# Altium project Toshiba_CB_3.PrjPcb
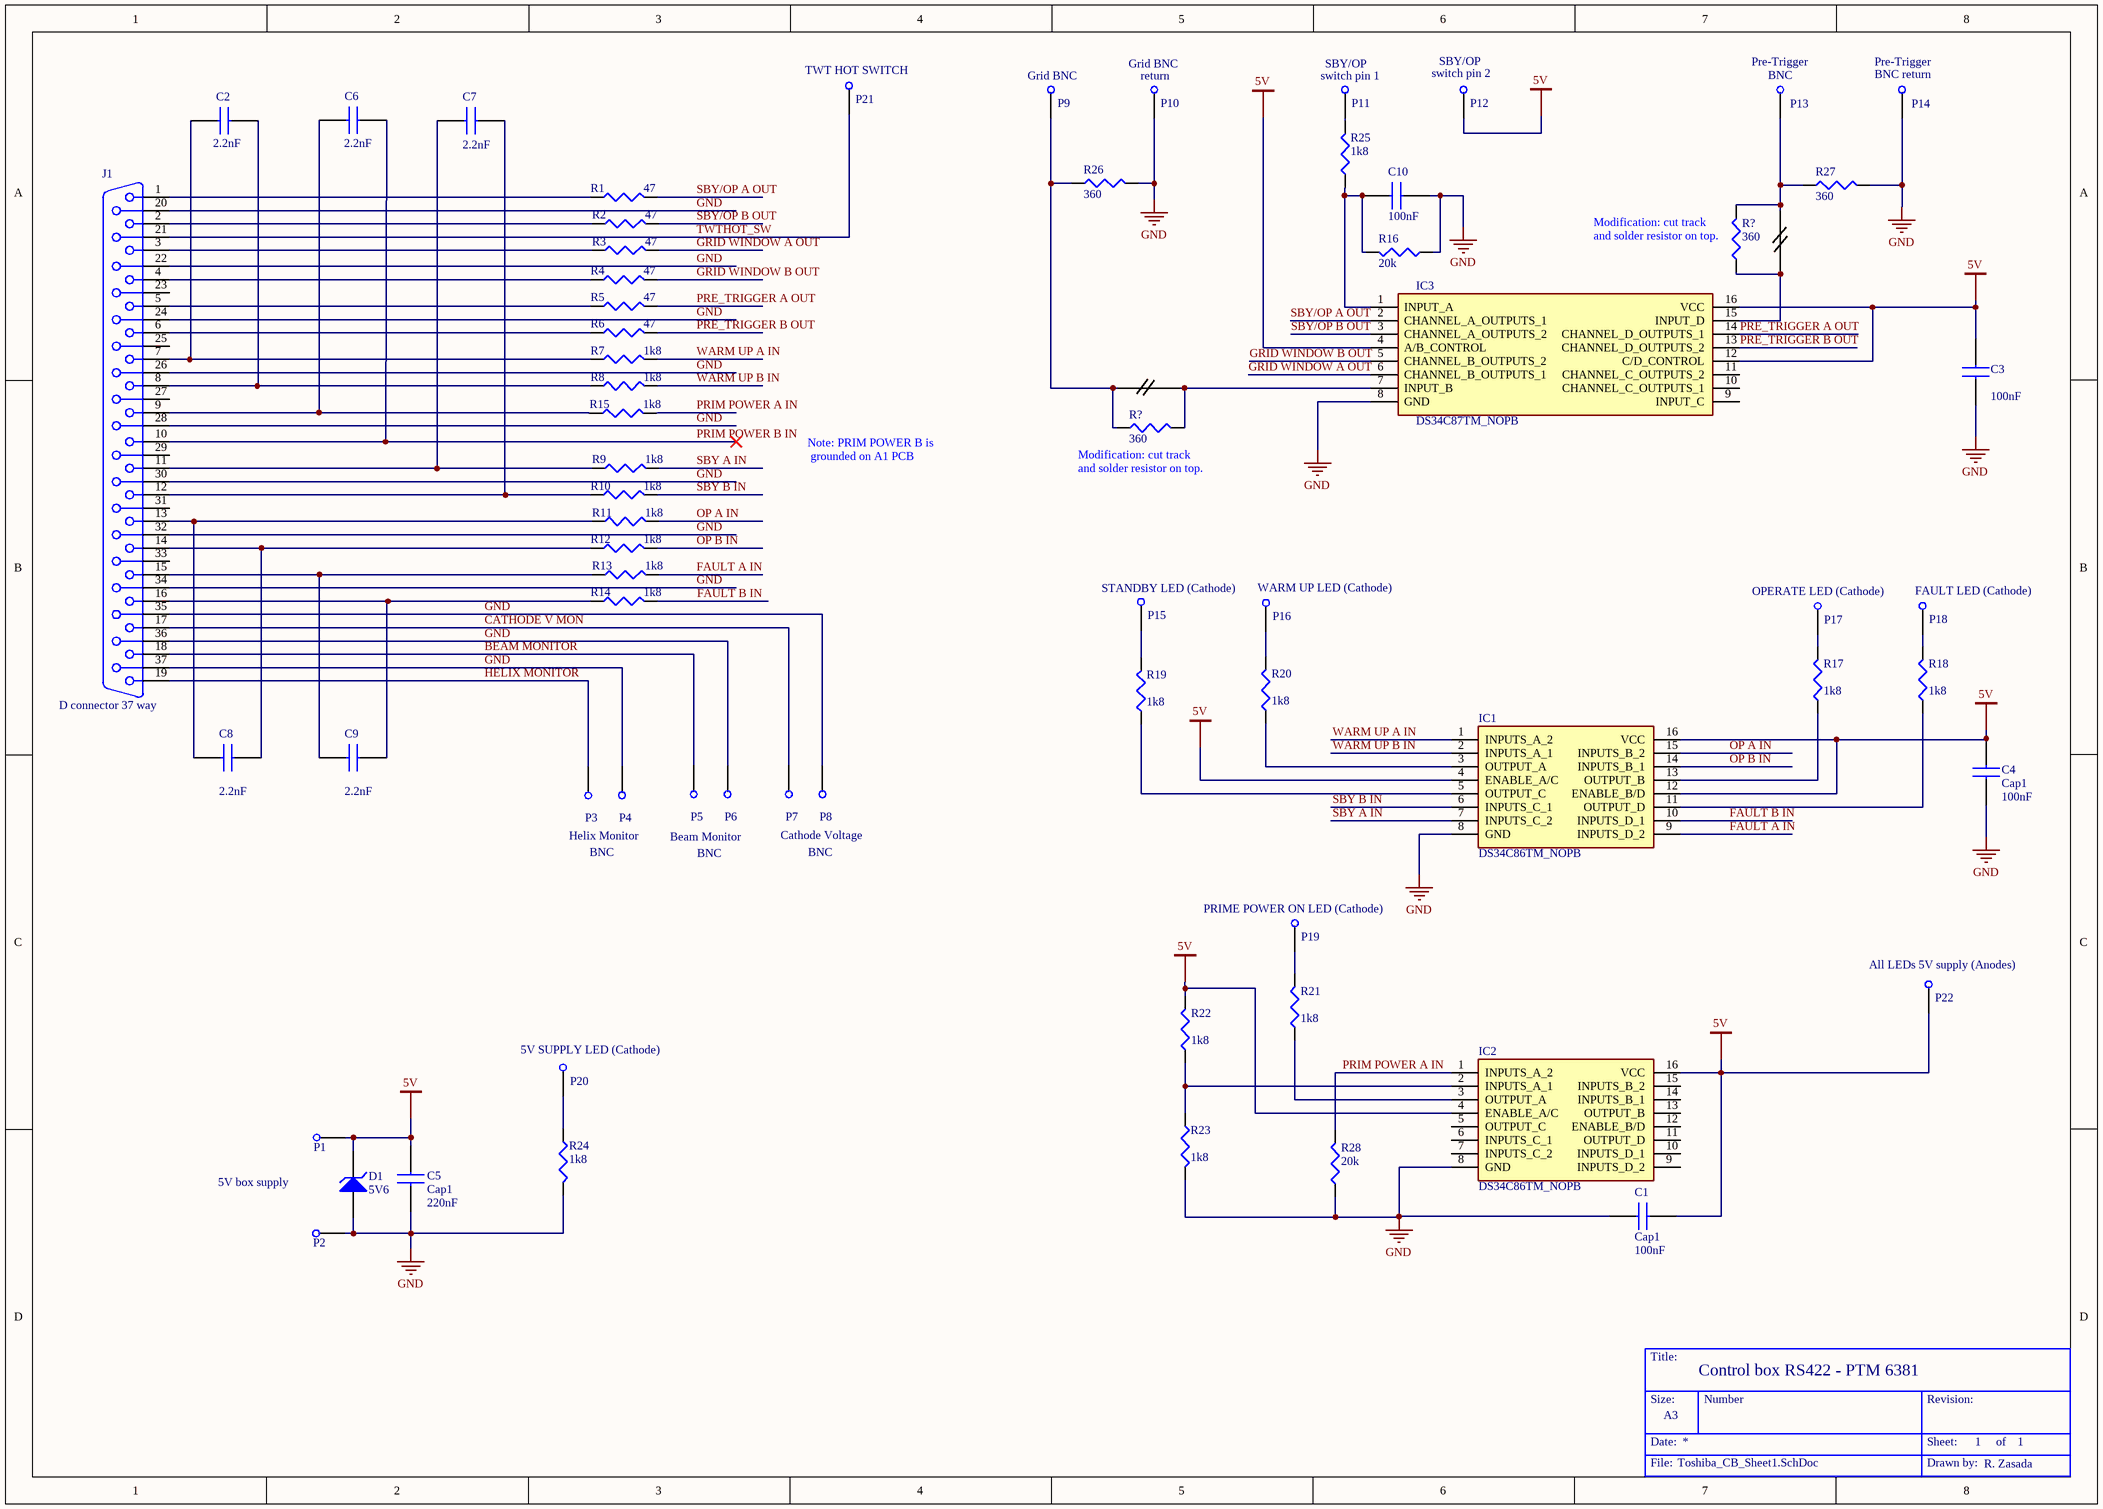
[diagram p0: Toshiba_CB_Sheet1.SchDoc]
1 sheet, 68 parts. Net scope: global (net labels, ports and power ports of the same name join across sheets).
Board file: Toshiba_CB_PCB1.PcbDoc

## Sheet Toshiba_CB_Sheet1.SchDoc: RS422 Control Box PTM 6381
size A3; CompanyName: TMD Technologies; Organization: TMD Technologies; DocumentNumber: 1; Revision: 1; SheetNumber: 1; SheetTotal: 1

### Parts
(Parts that share a designator on the sheet are numbered #1, #2 ... from top to bottom, then left to right.)
*  Title Block  (value not drawn)  (graphical)
C1  Cap1  value 100nF  [CAPC2012X94N]
C2  value 2.2nF  [CAPC2012X94N]  (hidden comment: Cap1)
C3  value 100nF  [CAPC2012X94N]  (hidden comment: Cap1)
C4  Cap1  value 100nF  [CAPC2012X94N]
C5  Cap1  value 220nF  [CAPC2012X94N]
C6  value 2.2nF  [CAPC2012X94N]  (hidden comment: Cap1)
C7  value 2.2nF  [CAPC2012X94N]  (hidden comment: Cap1)
C8  value 2.2nF  [CAPC2012X94N]  (hidden comment: Cap1)
C9  value 2.2nF  [CAPC2012X94N]  (hidden comment: Cap1)
C10  value 100nF  [CAPC2012X94N]  (hidden comment: Cap1)
D1  5V6  [Diode]
IC1  DS34C86TM_NOPB  [SOIC127P600X175-16N]
IC2  DS34C86TM_NOPB  [SOIC127P600X175-16N]
IC3  DS34C87TM_NOPB  [SOIC127P600X175-16N]
J1  D connector 37 way  [D connector 37 way]
P1  Pin1  [pin1]  (value not drawn)
P2  Pin1  [pin1]  (value not drawn)
P3  Pin1  [pin1]  (value not drawn)
P4  Pin1  [pin1]  (value not drawn)
P5  Pin1  [pin1]  (value not drawn)
P6  Pin1  [pin1]  (value not drawn)
P7  Pin1  [pin1]  (value not drawn)
P8  Pin1  [pin1]  (value not drawn)
P9  Pin1  [pin1]  (value not drawn)
P10  Pin1  [pin1]  (value not drawn)
P11  Pin1  [pin1]  (value not drawn)
P12  Pin1  [pin1]  (value not drawn)
P13  Pin1  [pin1]  (value not drawn)
P14  Pin1  [pin1]  (value not drawn)
P15  Pin1  [pin1]  (value not drawn)
P16  Pin1  [pin1]  (value not drawn)
P17  Pin1  [pin1]  (value not drawn)
P18  Pin1  [pin1]  (value not drawn)
P19  Pin1  [pin1]  (value not drawn)
P20  Pin1  [pin1]  (value not drawn)
P21  Pin1  [pin1]  (value not drawn)
P22  Pin1  [pin1]  (value not drawn)
R1  value 47  [Res1 0805]  (hidden comment: Res1)
R2  value 47  [Res1 0805]  (hidden comment: Res1)
R3  value 47  [Res1 0805]  (hidden comment: Res1)
R4  value 47  [Res1 0805]  (hidden comment: Res1)
R5  value 47  [Res1 0805]  (hidden comment: Res1)
R6  value 47  [Res1 0805]  (hidden comment: Res1)
R7  value 1k8  [Res1 0805]  (hidden comment: Res1)
R8  value 1k8  [Res1 0805]  (hidden comment: Res1)
R9  value 1k8  [Res1 0805]  (hidden comment: Res1)
R10  value 1k8  [Res1 0805]  (hidden comment: Res1)
R11  value 1k8  [Res1 0805]  (hidden comment: Res1)
R12  value 1k8  [Res1 0805]  (hidden comment: Res1)
R13  value 1k8  [Res1 0805]  (hidden comment: Res1)
R14  value 1k8  [Res1 0805]  (hidden comment: Res1)
R15  value 1k8  [Res1 0805]  (hidden comment: Res1)
R16  value 20k  [Res1 0805]  (hidden comment: Res1)
R17  value 1k8  [Res1 0805]  (hidden comment: Res1)
R18  value 1k8  [Res1 0805]  (hidden comment: Res1)
R19  value 1k8  [Res1 0805]  (hidden comment: Res1)
R20  value 1k8  [Res1 0805]  (hidden comment: Res1)
R21  value 1k8  [Res1 0805]  (hidden comment: Res1)
R22  value 1k8  [Res1 0805]  (hidden comment: Res1)
R23  value 1k8  [Res1 0805]  (hidden comment: Res1)
R24  value 1k8  [Res1 0805]  (hidden comment: Res1)
R25  value 1k8  [Res1 0805]  (hidden comment: Res1)
R26  value 360  [Res1 0805]  (hidden comment: Res1)
R27  value 360  [Res1 0805]  (hidden comment: Res1)
R28  value 20k  [Res1 0805]  (hidden comment: Res1)
R?#1  value 360  [Res1 0805]  (hidden comment: Res1)
R?#2  value 360  [Res1 0805]  (hidden comment: Res1)

### Nets
5V: C1.1 C3.1 C4.1 C5.2 D1.2(K) IC1.4(ENABLE_A/C) IC1.12(ENABLE_B/D) IC1.16(VCC) IC2.4(ENABLE_A/C) IC2.16(VCC) IC3.4(A/B_CONTROL) IC3.12(C/D_CONTROL) IC3.16(VCC) P1.1 P12.1 P22.1 R22.2
GND: C1.2 C3.2 C4.2 C5.1 C10.1 D1.1(A) IC1.8(GND) IC2.8(GND) IC3.8(GND) J1.20 J1.22 J1.24 J1.26 J1.28 J1.30 J1.32 J1.34 J1.35 J1.36 J1.37 P2.1 P4.1 P6.1 P8.1 P10.1 P14.1 R16.1 R23.2 R24.2 R26.2 R27.2 R28.1
BEAM MONITOR: J1.18 P5.1
CATHODE V MON: J1.17 P7.1
FAULT A IN: IC1.9(INPUTS_D_2) R13.2
FAULT B IN: IC1.10(INPUTS_D_1) R14.2
GRID WINDOW A OUT: IC3.6(CHANNEL_B_OUTPUTS_1) R3.2
GRID WINDOW B OUT: IC3.5(CHANNEL_B_OUTPUTS_2) R4.2
HELIX MONITOR: J1.19 P3.1
OP A IN: IC1.15(INPUTS_B_2) R11.2
OP B IN: IC1.14(INPUTS_B_1) R12.2
PRE_TRIGGER A OUT: IC3.14(CHANNEL_D_OUTPUTS_1) R5.2
PRE_TRIGGER B OUT: IC3.13(CHANNEL_D_OUTPUTS_2) R6.2
PRIM POWER A IN: IC2.1(INPUTS_A_2) R15.2 R28.2
PRIM POWER B IN: C6.1 J1.10
SBY A IN: IC1.7(INPUTS_C_2) R9.2
SBY B IN: IC1.6(INPUTS_C_1) R10.2
SBY/OP A OUT: IC3.2(CHANNEL_A_OUTPUTS_1) R1.2
SBY/OP B OUT: IC3.3(CHANNEL_A_OUTPUTS_2) R2.2
TWTHOT_SW: J1.21 P21.1
WARM UP A IN: IC1.1(INPUTS_A_2) R7.2
WARM UP B IN: IC1.2(INPUTS_A_1) R8.2
NetC2_1: C2.1 J1.8 R8.1
NetC2_2: C2.2 J1.7 R7.1
NetC6_2: C6.2 J1.9 R15.1
NetC7_1: C7.1 J1.12 R10.1
NetC7_2: C7.2 J1.11 R9.1
NetC8_1: C8.1 J1.14 R12.1
NetC8_2: C8.2 J1.13 R11.1
NetC9_1: C9.1 J1.16 R14.1
NetC9_2: C9.2 J1.15 R13.1
NetC10_2: C10.2 IC3.1(INPUT_A) R16.2 R25.1
NetIC1_3: IC1.3(OUTPUT_A) R20.1
NetIC1_5: IC1.5(OUTPUT_C) R19.1
NetIC1_11: IC1.11(OUTPUT_D) R18.1
NetIC1_13: IC1.13(OUTPUT_B) R17.1
NetIC2_2: IC2.2(INPUTS_A_1) R22.1 R23.1
NetIC2_3: IC2.3(OUTPUT_A) R21.1
NetIC3_7: IC3.7(INPUT_B) R?#2.2
NetIC3_15: IC3.15(INPUT_D) R?#1.1
NetJ1_1: J1.1 R1.1
NetJ1_2: J1.2 R2.1
NetJ1_3: J1.3 R3.1
NetJ1_4: J1.4 R4.1
NetJ1_5: J1.5 R5.1
NetJ1_6: J1.6 R6.1
NetP9_1: P9.1 R26.1 R?#2.1
NetP11_1: P11.1 R25.2
NetP13_1: P13.1 R27.1 R?#1.2
NetP15_1: P15.1 R19.2
NetP16_1: P16.1 R20.2
NetP17_1: P17.1 R17.2
NetP18_1: P18.1 R18.2
NetP19_1: P19.1 R21.2
NetP20_1: P20.1 R24.1

Not connected (* = marked no-connect by the designer): IC2 5(OUTPUT_C) 6(INPUTS_C_1) 7(INPUTS_C_2) 9(INPUTS_D_2) 10(INPUTS_D_1) 11(OUTPUT_D) 12(ENABLE_B/D) 13(OUTPUT_B) 14(INPUTS_B_1) 15(INPUTS_B_2); IC3 9(INPUT_C) 10(CHANNEL_C_OUTPUTS_1) 11(CHANNEL_C_OUTPUTS_2); J1 23 25 27 29 31 33

### Notes on the sheet
- (near P21) TWT HOT SWITCH
- (near P9) Grid BNC
- (near P10) Grid BNC
- (near P10) return
- (near P11) switch pin 1
- (near P11) SBY/OP
- (near P12) switch pin 2
- (near P12) SBY/OP
- (near P13) Pre-Trigger
- (near P13) BNC
- (near P14) BNC return
- (near P14) Pre-Trigger
- (near R?#1) Modification: cut track
  and solder resistor on top.
- Note: PRIM POWER B is
  grounded on A1 PCB
- (near R?#2) Modification: cut track
  and solder resistor on top.
- (near P15) STANDBY LED (Cathode)
- (near P16) WARM UP LED (Cathode)
- (near P17) OPERATE LED (Cathode)
- (near P18) FAULT LED (Cathode)
- Helix Monitor
- BNC
- Beam Monitor
- Cathode Voltage
- (near P19) PRIME POWER ON LED (Cathode)
- (near P22) All LEDs 5V supply (Anodes)
- (near P20) 5V SUPPLY LED (Cathode)
- 5V box supply
- A3
- R. Zasada
- Title
- Size:
- Date:
- Number:
- Time:
- Revision:
- Sheet
- of
- File:
- (in symbol Title Block) Title:; Control box RS422 - PTM 6381; Size:; Number; Revision:; Date:; Sheet:; of; File:; Drawn by:

### Library data of the parts
C1-C10 = Cap1: Capacitor; Manufacturer_Name: AVX; Manufacturer_Part_Number: 08055C104KAT2A; Allied_Number: 70002096; Datasheet Link: http://uk.rs-online.com/web/p/products/4646688P; Height: 0.94mm; RS Part Number: 4646688P; RS Price/Stock: http://uk.rs-online.com/web/p/products/4646688P
D1 = D Zener: Zener Diode; Published: 8-Jun-2000; LatestRevisionDate: 17-Jul-2002; LatestRevisionNote: Re-released for DXP Platform.; PackageReference: DIODE-0.7; Publisher: Altium Limited
IC1 IC2 = DS34C86TM_NOPB: Integrated Circuit; Manufacturer_Name: Texas Instruments; Manufacturer_Part_Number: DS34C86TM/NOPB; Datasheet Link: http://uk.rs-online.com/web/p/products/0460607P; Height: 1.75mm; RS Part Number: 0460607P; RS Price/Stock: http://uk.rs-online.com/web/p/products/0460607P
IC3 = DS34C87TM_NOPB: Integrated Circuit; Manufacturer_Name: Texas Instruments; Manufacturer_Part_Number: DS34C87TM/NOPB; Datasheet Link: http://uk.rs-online.com/web/p/products/0460651; Height: 1.75mm; RS Part Number: 0460651; RS Price/Stock: http://uk.rs-online.com/web/p/products/0460651
J1 = D connector 37 way: Receptacle Assembly, 37 Position, Right Angle; PackageDocument: U; Positions: 25; Published: 15-Jun-2001; LatestRevisionDate: 17-Jul-2002; LatestRevisionNote: Re-released for DXP Platform.; DatasheetDocument: 19-Mar-1999; PackageReference: 787202; Publisher: Altium Limited; Orientation: Right Angle; Gender: Receptacle
R1-R28 R?#1 R?#2 = Res1: 0805 resistor; Published: 8-Jun-2000; LatestRevisionDate: 29-May-2009; LatestRevisionNote: IPC-7351 Footprint Added.; PackageReference: J1-0603; Publisher: Altium Limited; PackageDescription: Chip Resistor